# EAGLE design LipSync_Mini_Main_Board (EAGLE 9.5.0)
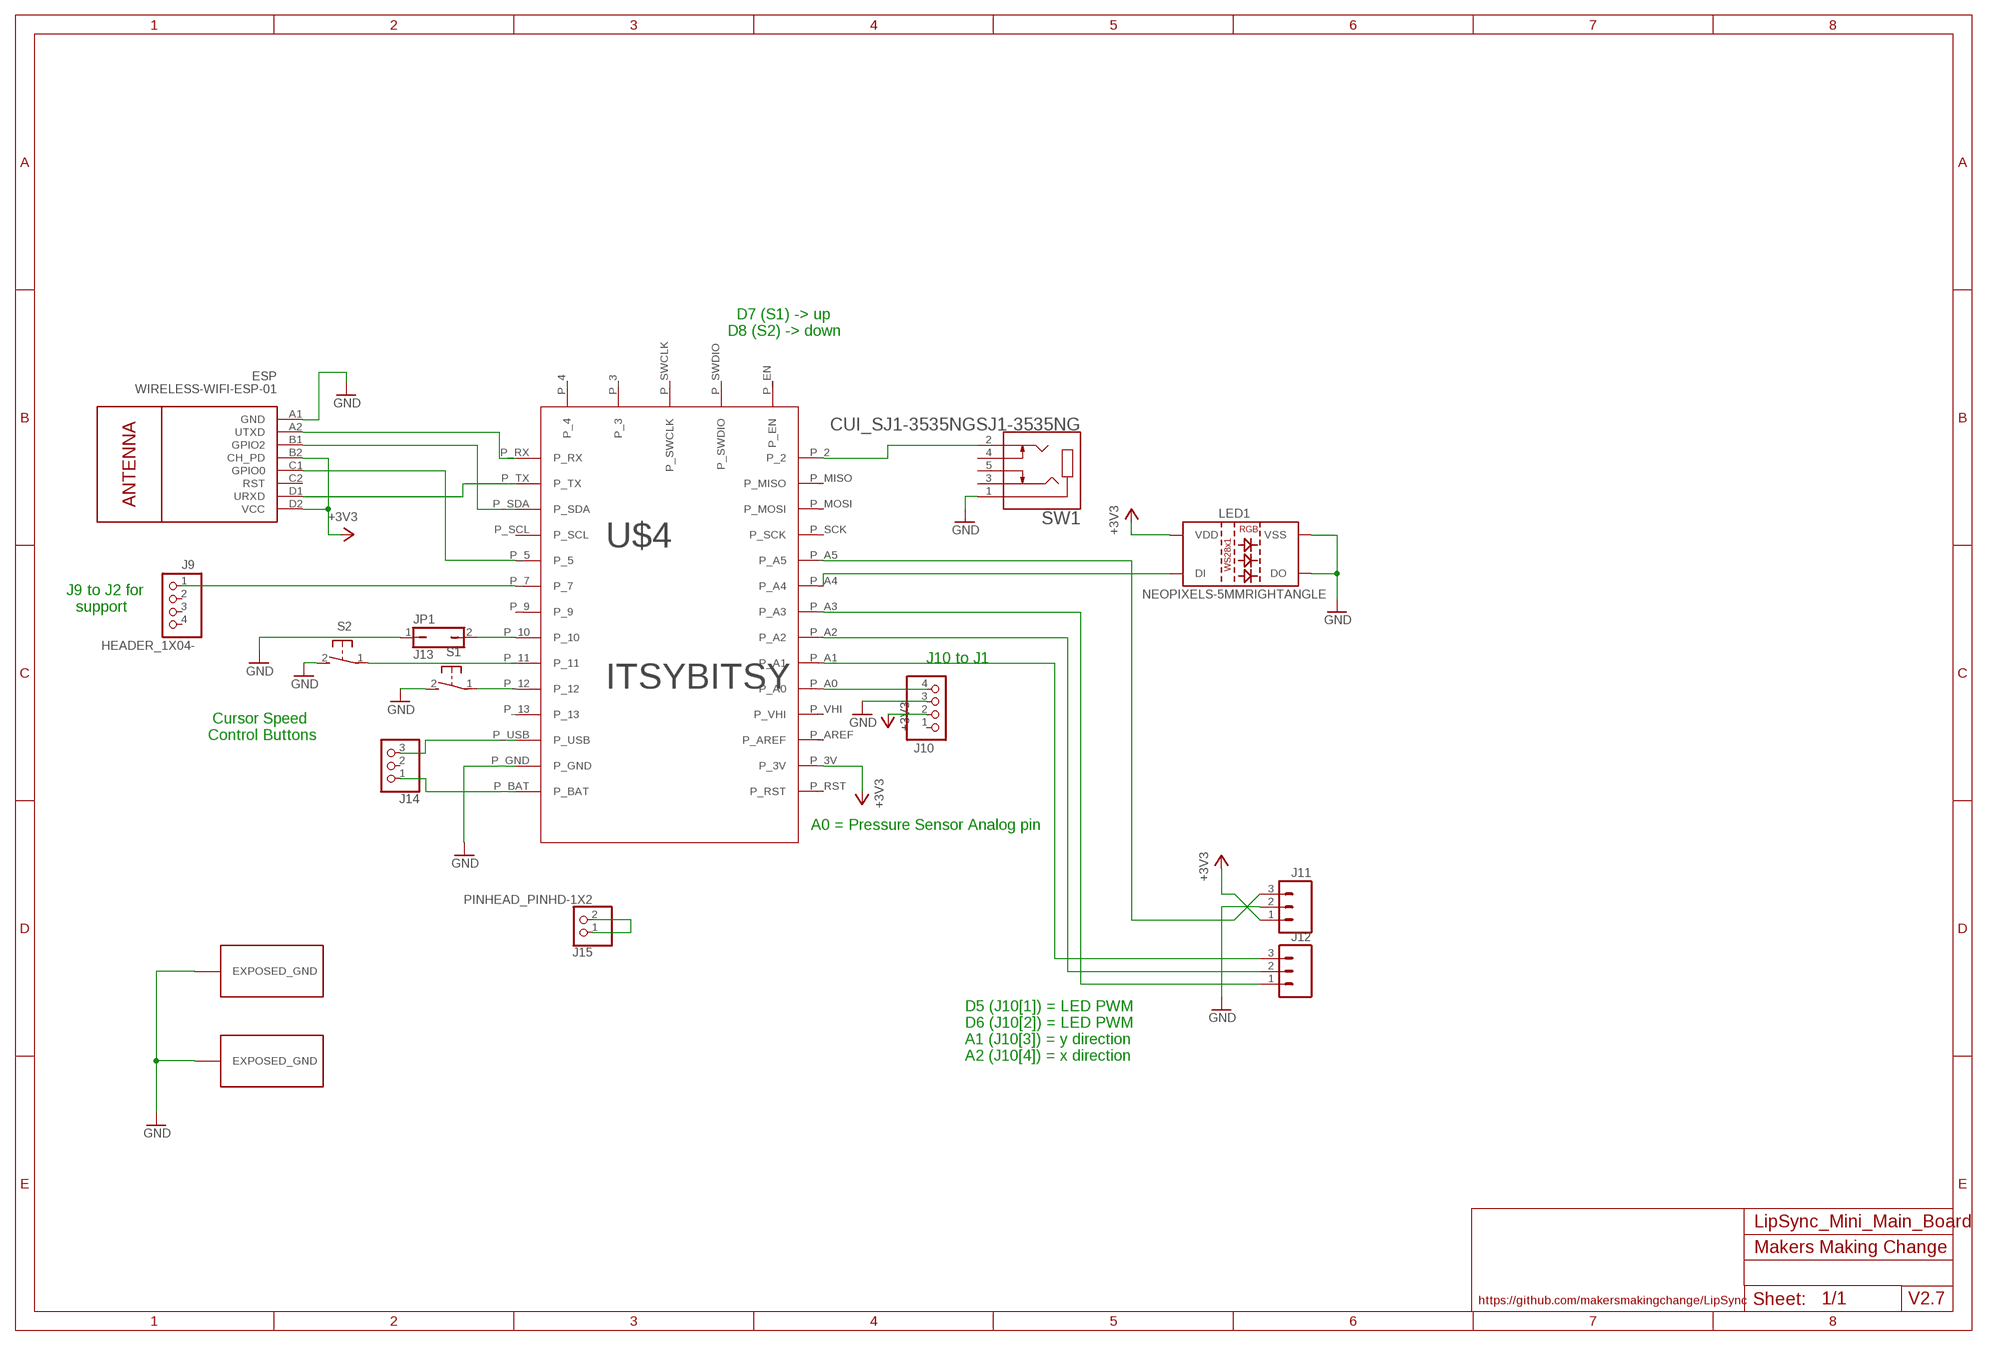
[diagram p0: schematic, sheet 1]

## Parts
ESP  WIRELESS-WIFI-ESP-01  [WIRELESS-WIFI-ESP-01]
J9  HEADER_1X04-  [1X04]
J10  HEADER_1X04-  [1X04]
J11  HEADER_1X03-/90  [1X03_LOCK/90]
J12  HEADER_1X03-/90  [1X03_LOCK/90]
J13  JP1  [JP1]
J14  PINHEAD_PINHD-1X3  [PINHEAD_1X03]
J15  PINHEAD_PINHD-1X2  [PINHEAD_1X02]
LED1  NEOPIXELS-5MMRIGHTANGLE  [NEOPIXELS-RIGHTANGLE-5MM]
S1  B3F_31-XXSKINNY  [B3F-31XX-SKINNIER]
S2  B3F_31-XXSKINNY  [B3F-31XX-SKINNIER]
SW1  CUI_SJ1-3535NGSJ1-3535NG  [CUI_SJ1-3535NG]
U$2  EXPOSED_GND  [EXPOSED_GND]
U$3  EXPOSED_GND  [EXPOSED_GND]
U$4  ITSYBITSY  [ITSYBITSY]

## Nets
+3V3: ESP.B2(CH_PD) ESP.D2(VCC) J10.2 J11.1 LED1.P2(VDD) U$4.P_3V
GND: ESP.A1(GND) J10.3 J11.2 J13.1 LED1.P3(VSS) LED1.P4(DO) S1.2(S) S2.2(S) SW1.1 U$2.GND1(EXPOSED_GND) U$3.GND1(EXPOSED_GND) U$4.P_GND
N$1: S1.1(P) U$4.P_12
N$2: S2.1(P) U$4.P_11
N$3: J13.2 U$4.P_10
N$4: LED1.P1(DI) U$4.P_A4
N$5: J12.3 U$4.P_A1
N$6: J12.2 U$4.P_A2
N$7: ESP.D1(URXD) U$4.P_TX
N$8: ESP.A2(UTXD) U$4.P_RX
N$9: ESP.B1(GPIO2) U$4.P_SDA
N$10: J11.3 U$4.P_A5
N$11: J10.4 U$4.P_A0
N$12: J14.3 U$4.P_USB
N$13: J14.1 U$4.P_BAT
N$14: ESP.C1(GPIO0) U$4.P_5
N$15: SW1.2 U$4.P_2
N$16: J12.1 U$4.P_A3
N$17: J15.1 J15.2
N$18: J9.1 U$4.P_7
Unconnected: ESP.C2(RST) J9.2 J9.3 J9.4 J10.1 J14.2 SW1.3 SW1.4 SW1.5 U$4.P_3 U$4.P_4 U$4.P_9 U$4.P_13 U$4.P_AREF U$4.P_EN U$4.P_MISO U$4.P_MOSI U$4.P_RST U$4.P_SCK U$4.P_SCL U$4.P_SWCLK U$4.P_SWDIO U$4.P_VHI

## Notes on the sheet
- D7 (S1) -> up
  D8 (S2) -> down
- J9 to J2 for
    support
- J10 to J1
- Cursor Speed
  Control Buttons
- A0 = Pressure Sensor Analog pin
- D5 (J10[1]) = LED PWM
  D6 (J10[2]) = LED PWM
  A1 (J10[3]) = y direction
  A2 (J10[4]) = x direction
- Makers Making Change
- https://github.com/makersmakingchange/LipSync | V2.7

## Library data of the parts
ESP = MMC Eagle:WIRELESS-WIFI-ESP-01: Wireless Wi-Fi ESP-01 Module based on ESP8266 chip Click here to find device on ebay.com <http://www.ebay.com/sch/esp8266+esp+01+transceiver>
J9 J10 = MMC Eagle:HEADER_1X04-
J11 J12 = MMC Eagle:HEADER_1X03-: Multi connection point. Often used as Generic Header-pin footprint for 0.1 inch spaced/style header connections On any of the 0.1 inch spaced packages, you can populate with these: Break Away Headers - Straight <https://www.sparkfun.com/products/116> (PRT-00116) Break Away Male Headers - Right Angle <https://www.sparkfun.com/products/553> (PRT-00553) Female Headers <https://www.sparkfun.com/products/115> (PRT-00115) Break Away Headers - Machine Pin <https://www.sparkfun.com/products/117> (PRT-00117) Break Away Female Headers - Swiss Machine Pin <https://www.sparkfun.com/products/743> (PRT-00743) Stackable Header - 3 Pin (Female, 0.1") <https://www.sparkfun.com/products/13875> (PRT-13875) For SCREWTERMINALS and SPRING TERMINALS visit here: Screw Terimnals on SparkFun.com <https://www.sparkfun.com/search/results?term=Screw+Terminals> (5mm/3.5mm/2.54mm spacing) This device is also useful as a general connection point to wire up your design to another part of your project. Our various solder wires solder well into these plated through hole pads. Hook-Up Wire - Assortment (Stranded, 22 AWG) <https://www.sparkfun.com/products/11375> (PRT-11375) Hook-Up Wire - Assortment (Solid Core, 22 AWG) <https://www.sparkfun.com/products/11367> (PRT-11367) View the entire wire category on our website here <https://www.sparkfun.com/categories/141> Special notes: Molex polarized connector foot print use with SKU : PRT-08232 with associated crimp pins and housings.
J13 = MMC Eagle:JP1
J14 = MMC Eagle:PINHEAD_PINHD-1X3: PIN HEADER
J15 = MMC Eagle:PINHEAD_PINHD-1X2
LED1 = MMC Eagle:NEOPIXELS-5MM
S1 S2 = MMC Eagle:B3F_31-XX: OMRON SWITCH Now with beefier pads!
SW1 = MMC Eagle:CUI_SJ1-3535NG
U$2 = IVAN_custom:EXPOSED_GND: Exposed copper plane to connect ground to conductive ABS housing
U$3 = MMC Eagle:EXPOSED_GND: Exposed copper plane to connect ground to conductive ABS housing
U$4 = MMC Eagle:ITSYBITSY

## Net classes
0 GND: clearance 0.205 mm
2 GND2: clearance 0.205 mm to class 0, clearance 0.205 mm to class 1, clearance 0.205 mm
3 GND3: clearance 0.205 mm to class 0, clearance 0.205 mm to class 1, clearance 0.205 mm to class 2, clearance 0.205 mm

## Board
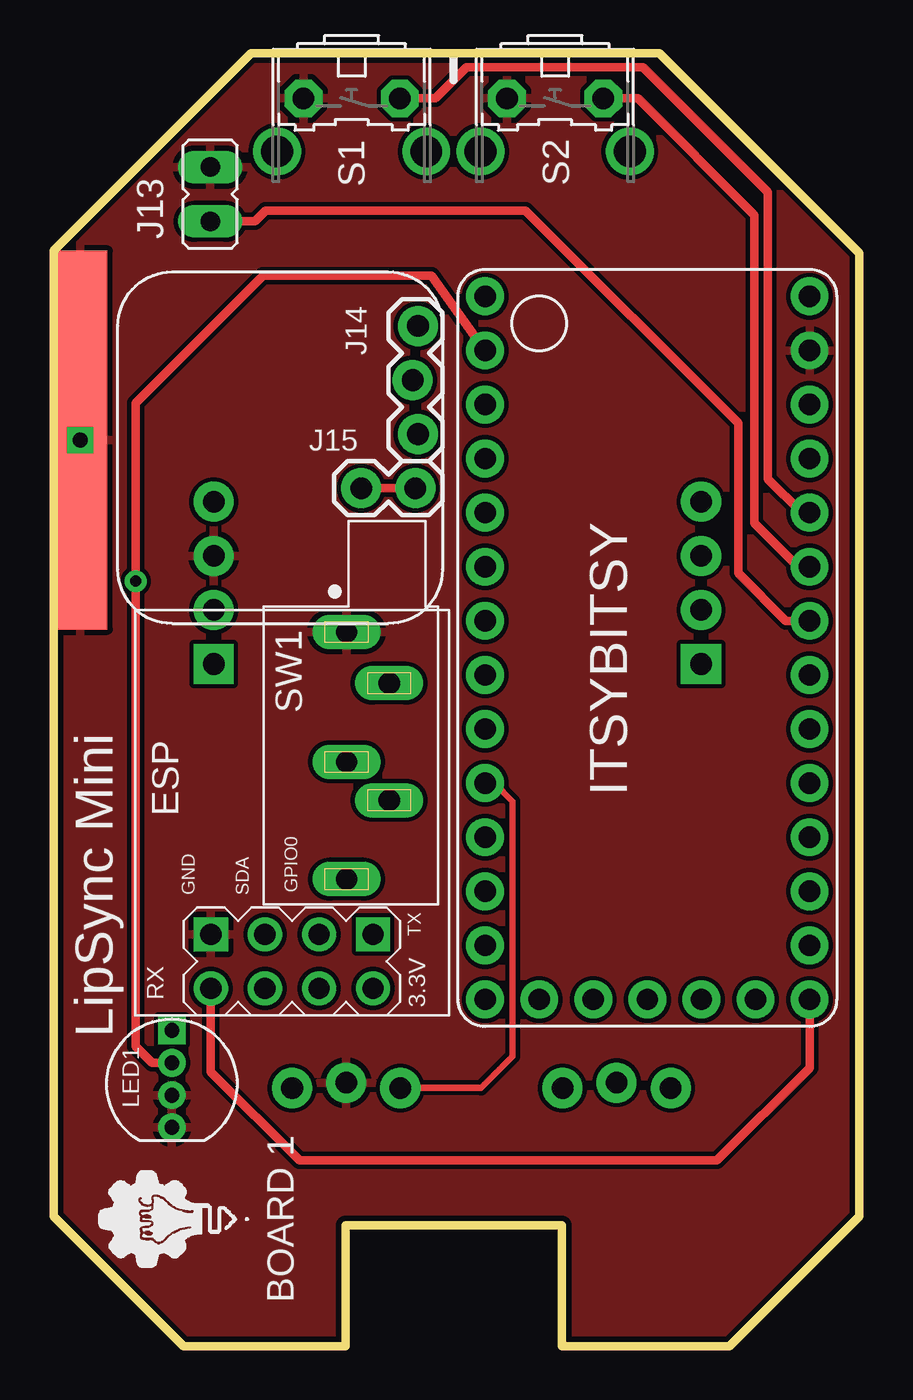
[diagram p1: board, top side]
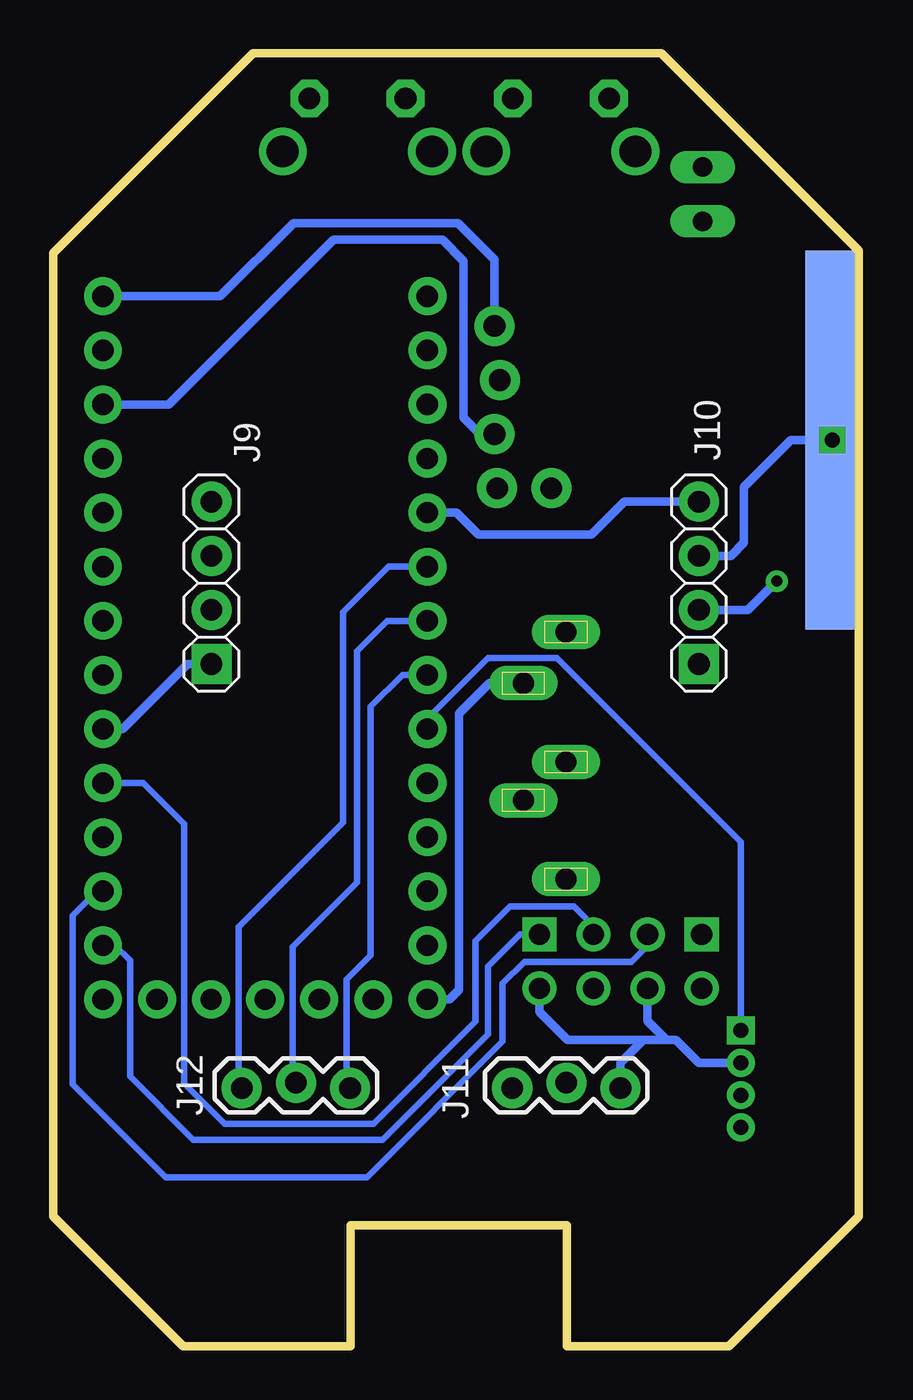
[diagram p2: board, bottom side, seen from below]

Size 37.85 x 60.72 mm. Coordinates in mm from the lower left corner, seen from the top.
Outline: 37.85,6.11 37.85,51.32 28.45,60.72 9.27,60.72 0,51.45 0,6.11 6.11,0 13.72,0 13.72,5.67 23.88,5.67 23.88,0 31.74,0 37.85,6.11
Copper layers (1*16): Top 0.035mm / dielectric 1.5mm / Bottom 0.035mm
Design rules "SparkFun": minimum track width 8mil, minimum drill 20mil, track to track 8mil, track to pad 8mil, pad to pad 8mil, via to via 8mil, smd to smd 8mil, copper to edge 10mil, drill to drill 8mil, minimum pad ring 12mil, minimum via ring 10mil, stop-mask expansion 4mil, vias tented up to drill 25mil, thermal gap 10mil

### Footprints (pad centres in the part's own frame; a part is rotated, then mirrored left to right if it is on the bottom)
WIRELESS-WIFI-ESP-01 = drill 1 square: A1 -8.89,3.81; D1 -8.89,-3.81 | drill 1: A2 -11.43,3.81; B1 -8.89,1.27; B2 -11.43,1.27; C1 -8.89,-1.27; C2 -11.43,-1.27; D2 -11.43,-3.81
1X04 = drill 1.016 pad 1.88 square: 1 -3.81,0 | drill 1.016 pad 1.88: 2 -1.27,0; 3 1.27,0; 4 3.81,0
1X03_LOCK/90 = drill 1.016 pad 1.88: 1 0,0.127; 2 2.54,-0.127; 3 5.08,0.127
JP1 = drill 0.914 long: 1 0,-1.27; 2 0,1.27
PINHEAD_1X03 = drill 1.016 pad 1.88: 1 0,0.127; 2 2.54,-0.127; 3 5.08,0.127
PINHEAD_1X02 = drill 1.016 pad 1.88: 1 0,0; 2 2.54,0
NEOPIXELS-RIGHTANGLE-5MM = drill 0.7 pad 1.016 square: P1 2.28,0 | drill 0.7 pad 1.016: P2 0.76,0; P3 -0.76,0; P4 -2.28,0
B3F-31XX-SKINNIER = drill 1.016 pad 1.778 octagon: 1 -2.261,-1.245; 2 2.261,-1.245 | drill 1.499 pad 2.032: 3 -3.505,1.245; 4 3.505,1.245
CUI_SJ1-3535NG = drill 1 long: 1 0,0; 2 2.4,2; 3 7.9,2; 4 11.6,0; 5 6.1,0
EXPOSED_GND = smd 2.54 x 17.78: GND1 0,0
ITSYBITSY = drill 1 pad 1.778: P_2 7.62,16.51; P_3 -2.54,16.51; P_3V 7.62,-13.97; P_4 -5.08,16.51; P_5 -7.62,6.35; P_7 -7.62,3.81; P_9 -7.62,1.27; P_10 -7.62,-1.27; P_11 -7.62,-3.81; P_12 -7.62,-6.35; P_13 -7.62,-8.89; P_A0 7.62,-6.35; P_A1 7.62,-3.81; P_A2 7.62,-1.27; P_A3 7.62,1.27; P_A4 7.62,3.81; P_A5 7.62,6.35; P_AREF 7.62,-11.43; P_BAT -7.62,-16.51; P_EN 5.08,16.51; P_GND -7.62,-13.97; P_MISO 7.62,13.97; P_MOSI 7.62,11.43; P_RST 7.62,-16.51; P_RX -7.62,16.51; P_SCK 7.62,8.89; P_SCL -7.62,8.89; P_SDA -7.62,11.43; P_SWCLK 0,16.51; P_SWDIO 2.54,16.51; P_TX -7.62,13.97; P_USB -7.62,-11.43; P_VHI 7.62,-8.89

### Placement (x,y rotation side)
ESP  11.2,28.23 90 top
J9  30.42,35.85 90 bottom
J10  7.52,35.85 90 bottom
J11  11.21,12.25 180 bottom
J12  23.91,12.25 180 bottom
J13  7.36,54.1 180 top
J14  16.99,47.91 270 top
J15  14.45,40.29 0 top
LED1  5.56,12.55 90 top
S1  14,57.35 180 top
S2  23.56,57.35 180 top
SW1  13.76,33.54 270 top
U$2  1.26,42.55 0 top
U$3  1.26,42.55 0 bottom
U$4  27.89,32.8 180 top

### Tracks (layer width: path | path; a pad name or v marks a point on that pad's centre or on a via)
+3V3  (via drill 0.51)
  Top 0.406: LED1.P2 4.63,13.31 3.86,14.08 v3.86,35.93 3.86,44.28 9.86,50.28 17.76,50.28 U$4.P_3V
  Bottom 0.406: J10.2 5.21,34.58 v3.86,35.93 | LED1.P2 7.53,13.31 8.61,14.39 9.04,14.39 | ESP.D2 15.01,15.71 13.69,14.39 10.14,14.39 | 9.04,14.39 10.14,14.39 | ESP.B2 9.93,15.28 9.04,14.39 | J11.1 11.21,13.32 10.14,14.39
GND  (via drill 0.7)
  Bottom 0.406: U$3.GND1 3.21,42.55 5.41,40.35 5.41,37.73 6.03,37.12 J10.3
  other vias: 1.26,42.55
  pour Top: 0,51.45 9.27,60.72 28.45,60.72 37.85,51.32 37.85,6.11 31.75,0 6.1,0 0,6.11
N$1
  Top 0.406: S1.1 17.95,58.6 19.41,60.06 27.69,60.06 33.55,54.19 33.55,40.73 35.14,39.14 U$4.P_12
N$2
  Top 0.406: S2.1 27.45,58.6 32.92,53.12 32.92,38.64 34.96,36.6 U$4.P_11
N$3
  Top 0.406: J13.2 9.46,52.83 9.96,53.33 22.17,53.33 32.16,43.34 32.16,36.31 34.4,34.06 U$4.P_10
N$4
  Bottom 0.305: U$4.P_A4 20.27,29.47 17.42,32.32 14.2,32.32 5.56,23.68 LED1.P1
N$5
  Bottom 0.305: U$4.P_A1 22.11,36.6 24.23,34.48 24.23,24.6 29.14,19.69 29.14,15.77 29.13,15.76 29.13,12.74 28.96,12.56 28.96,12.16 J12.3
N$6
  Bottom 0.305: U$4.P_A2 22.16,34.06 23.57,32.65 23.57,21.78 26.6,18.76 26.6,12.99 26.45,12.83 J12.2
N$7
  Bottom 0.305: ESP.D1 15.93,19.34 17.42,17.84 17.42,14.64 22.38,9.69 31.27,9.69 34.24,12.66 34.24,18.11 34.95,18.82 U$4.P_TX
N$8
  Top 0.406: U$4.P_RX 35.51,13.07 31.17,8.72 11.56,8.72 7.39,12.89 ESP.A2
N$9
  Bottom 0.305: U$4.P_SDA 35.8,21.36 36.93,20.23 36.93,12.31 32.56,7.94 23.11,7.94 16.74,14.31 16.74,17.03 15.72,18.05 10.69,18.05 9.93,18.81 ESP.B1
N$10
  Top 0.305: U$4.P_A5 20.71,26.45 21.57,25.59 21.57,13.6 20.09,12.12 J11.3
N$11
  Bottom 0.406: J10.4 11.03,39.66 12.57,38.11 17.88,38.11 18.91,39.14 U$4.P_A0
N$12
  Bottom 0.406: J14.3 17.8,42.83 18.57,43.6 18.57,50.96 19.56,51.95 24.69,51.95 32.42,44.23 U$4.P_USB
N$13
  Bottom 0.406: J14.1 17.12,51.02 18.85,52.74 26.57,52.74 30.01,49.3 U$4.P_BAT
N$14
  Bottom 0.305: ESP.C1 12.47,19.75 13.39,20.66 16.38,20.66 18.01,19.04 18.01,15.25 22.81,10.45 29.79,10.45 31.7,12.36 31.7,21.27 31.7,21.47 31.7,24.52 33.62,26.45 U$4.P_5
N$15
  Bottom 0.406: SW1.2 17.36,31.14 18.8,29.71 18.8,16.72 19.24,16.29 U$4.P_2
N$16
  Bottom 0.305: J12.1 23.91,12.5 24.06,12.66 24.06,17.23 22.94,18.35 22.94,30.03 21.45,31.52 U$4.P_A3
N$17
  Top 0.406: J15.2 J15.1
N$18
  Bottom 0.406: U$4.P_7 34.58,28.98 31.53,32.04 J9.1

### Text on the board
tNames: S1 | S2 | J13 | GND | SDA | GPIO0 | TX | RX | 3.3V | LipSync Mini | BOARD 1
bNames: J10 | J9 | J11 | J12